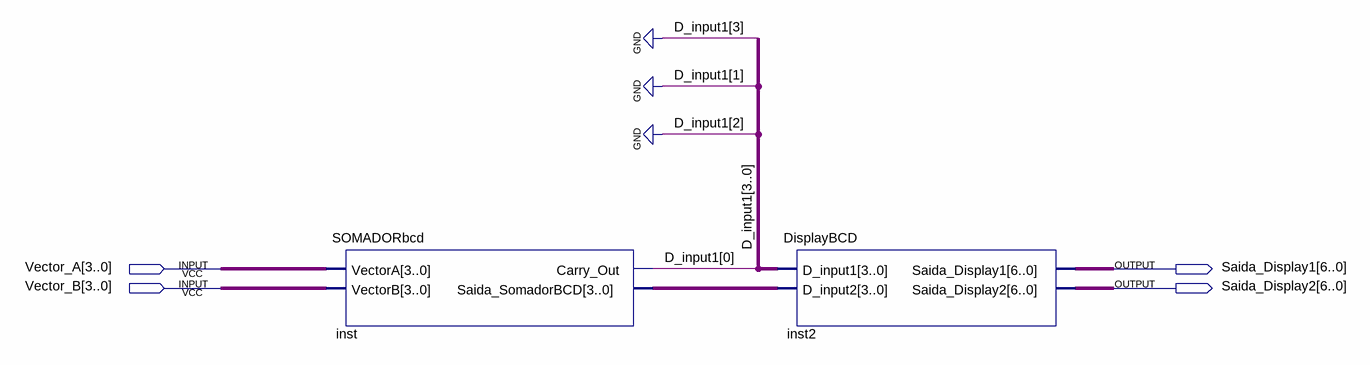
[diagram p0: schematic sheet]
// Quartus schematic BCDcDISPLAY.bdf as structural Verilog: 2 symbols, 4 pins
module BCDcDISPLAY (
  input  [3:0] Vector_A,
  input  [3:0] Vector_B,
  output [6:0] Saida_Display1,
  output [6:0] Saida_Display2
);

  wire [0:0] D_input1;
  wire [3:0] inst_saida_somadorbcd;

  SOMADORbcd inst (
    .VectorA(Vector_A), .VectorB(Vector_B), .Carry_Out(D_input1[0]), .Saida_SomadorBCD(inst_saida_somadorbcd));
  DisplayBCD inst2 (
    .D_input1({3'b000, D_input1[0]}), .D_input2(inst_saida_somadorbcd), .Saida_Display1(Saida_Display1),
    .Saida_Display2(Saida_Display2));
endmodule
